# Altium schematic sheet LCD Display.SchDoc
size D; SheetNumber: 6; SheetTotal: 7
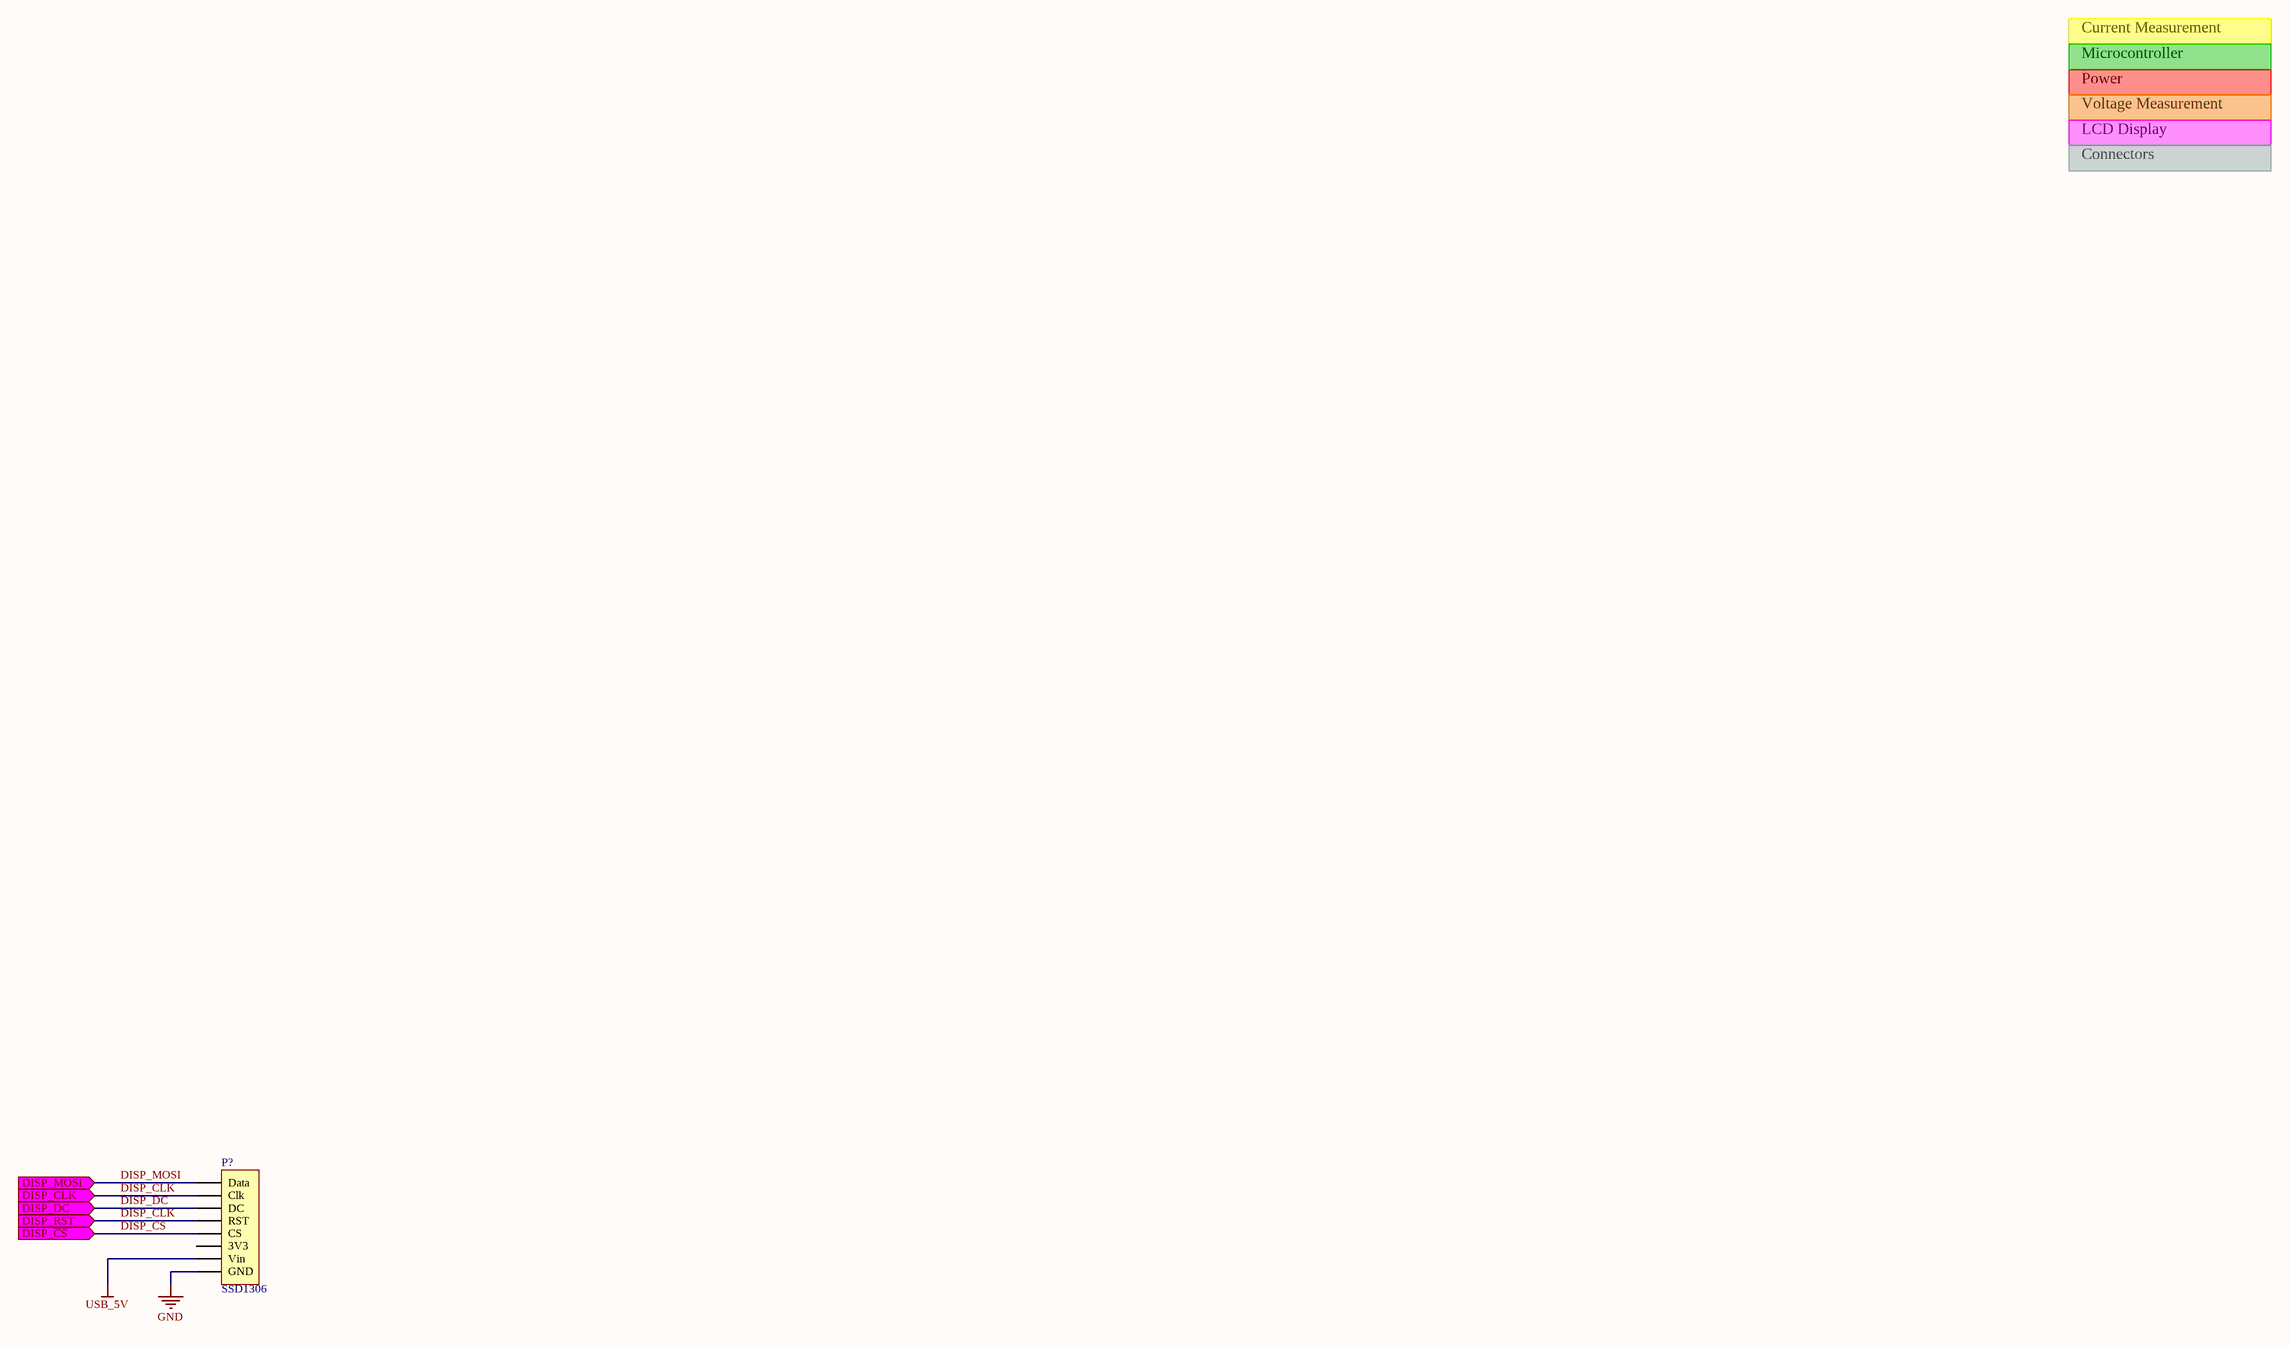
[diagram p0: LCD Display.SchDoc]

## Parts
P?  SSD1306  [OLED-header]

## Ports
DISP_CLK (in), DISP_DC (in), DISP_MOSI (in), DISP_RST (in), DISP_~{CS} (in)

## Nets
GND: P?.8(GND)
USB_5V: P?.7(Vin)
DISP_~{CS}: P?.5(CS) ; port DISP_~{CS}
DISP_CLK: P?.2(Clk) P?.4(RST) ; port DISP_CLK, port DISP_RST
DISP_DC: P?.3(DC) ; port DISP_DC
DISP_MOSI: P?.1(Data) ; port DISP_MOSI

Not connected (* = marked no-connect by the designer): P? 6(3V3)

## Notes on the sheet
- Current Measurement
- Microcontroller
- Power
- Voltage Measurement
- LCD Display
- Connectors

## Library data of the parts
P? = Header 8: Header, 8-Pin; Manufacturer: AdaFruit; MF_PN: SSD1306